# EAGLE schematic magicBoard (EAGLE 9.6.2)
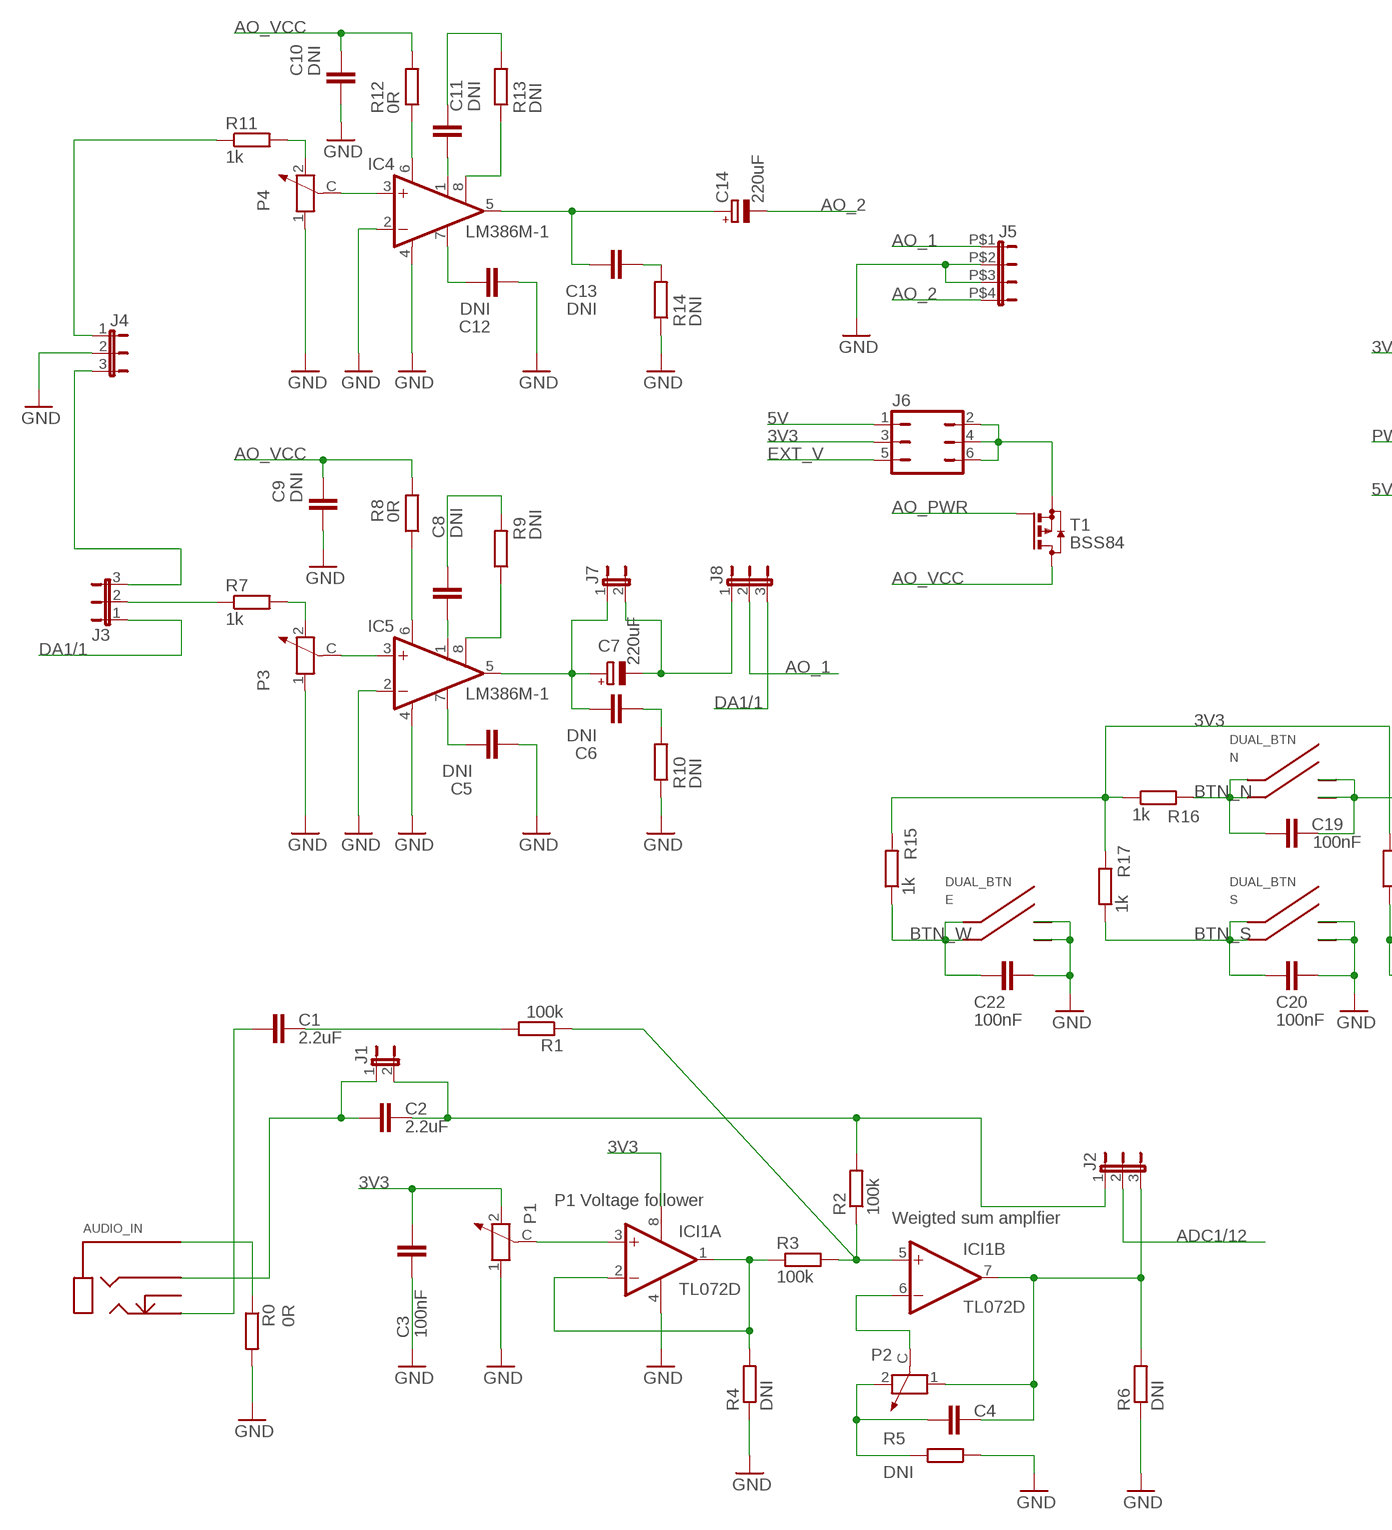
[diagram p0: schematic, sheet 1, part 1 of 2]
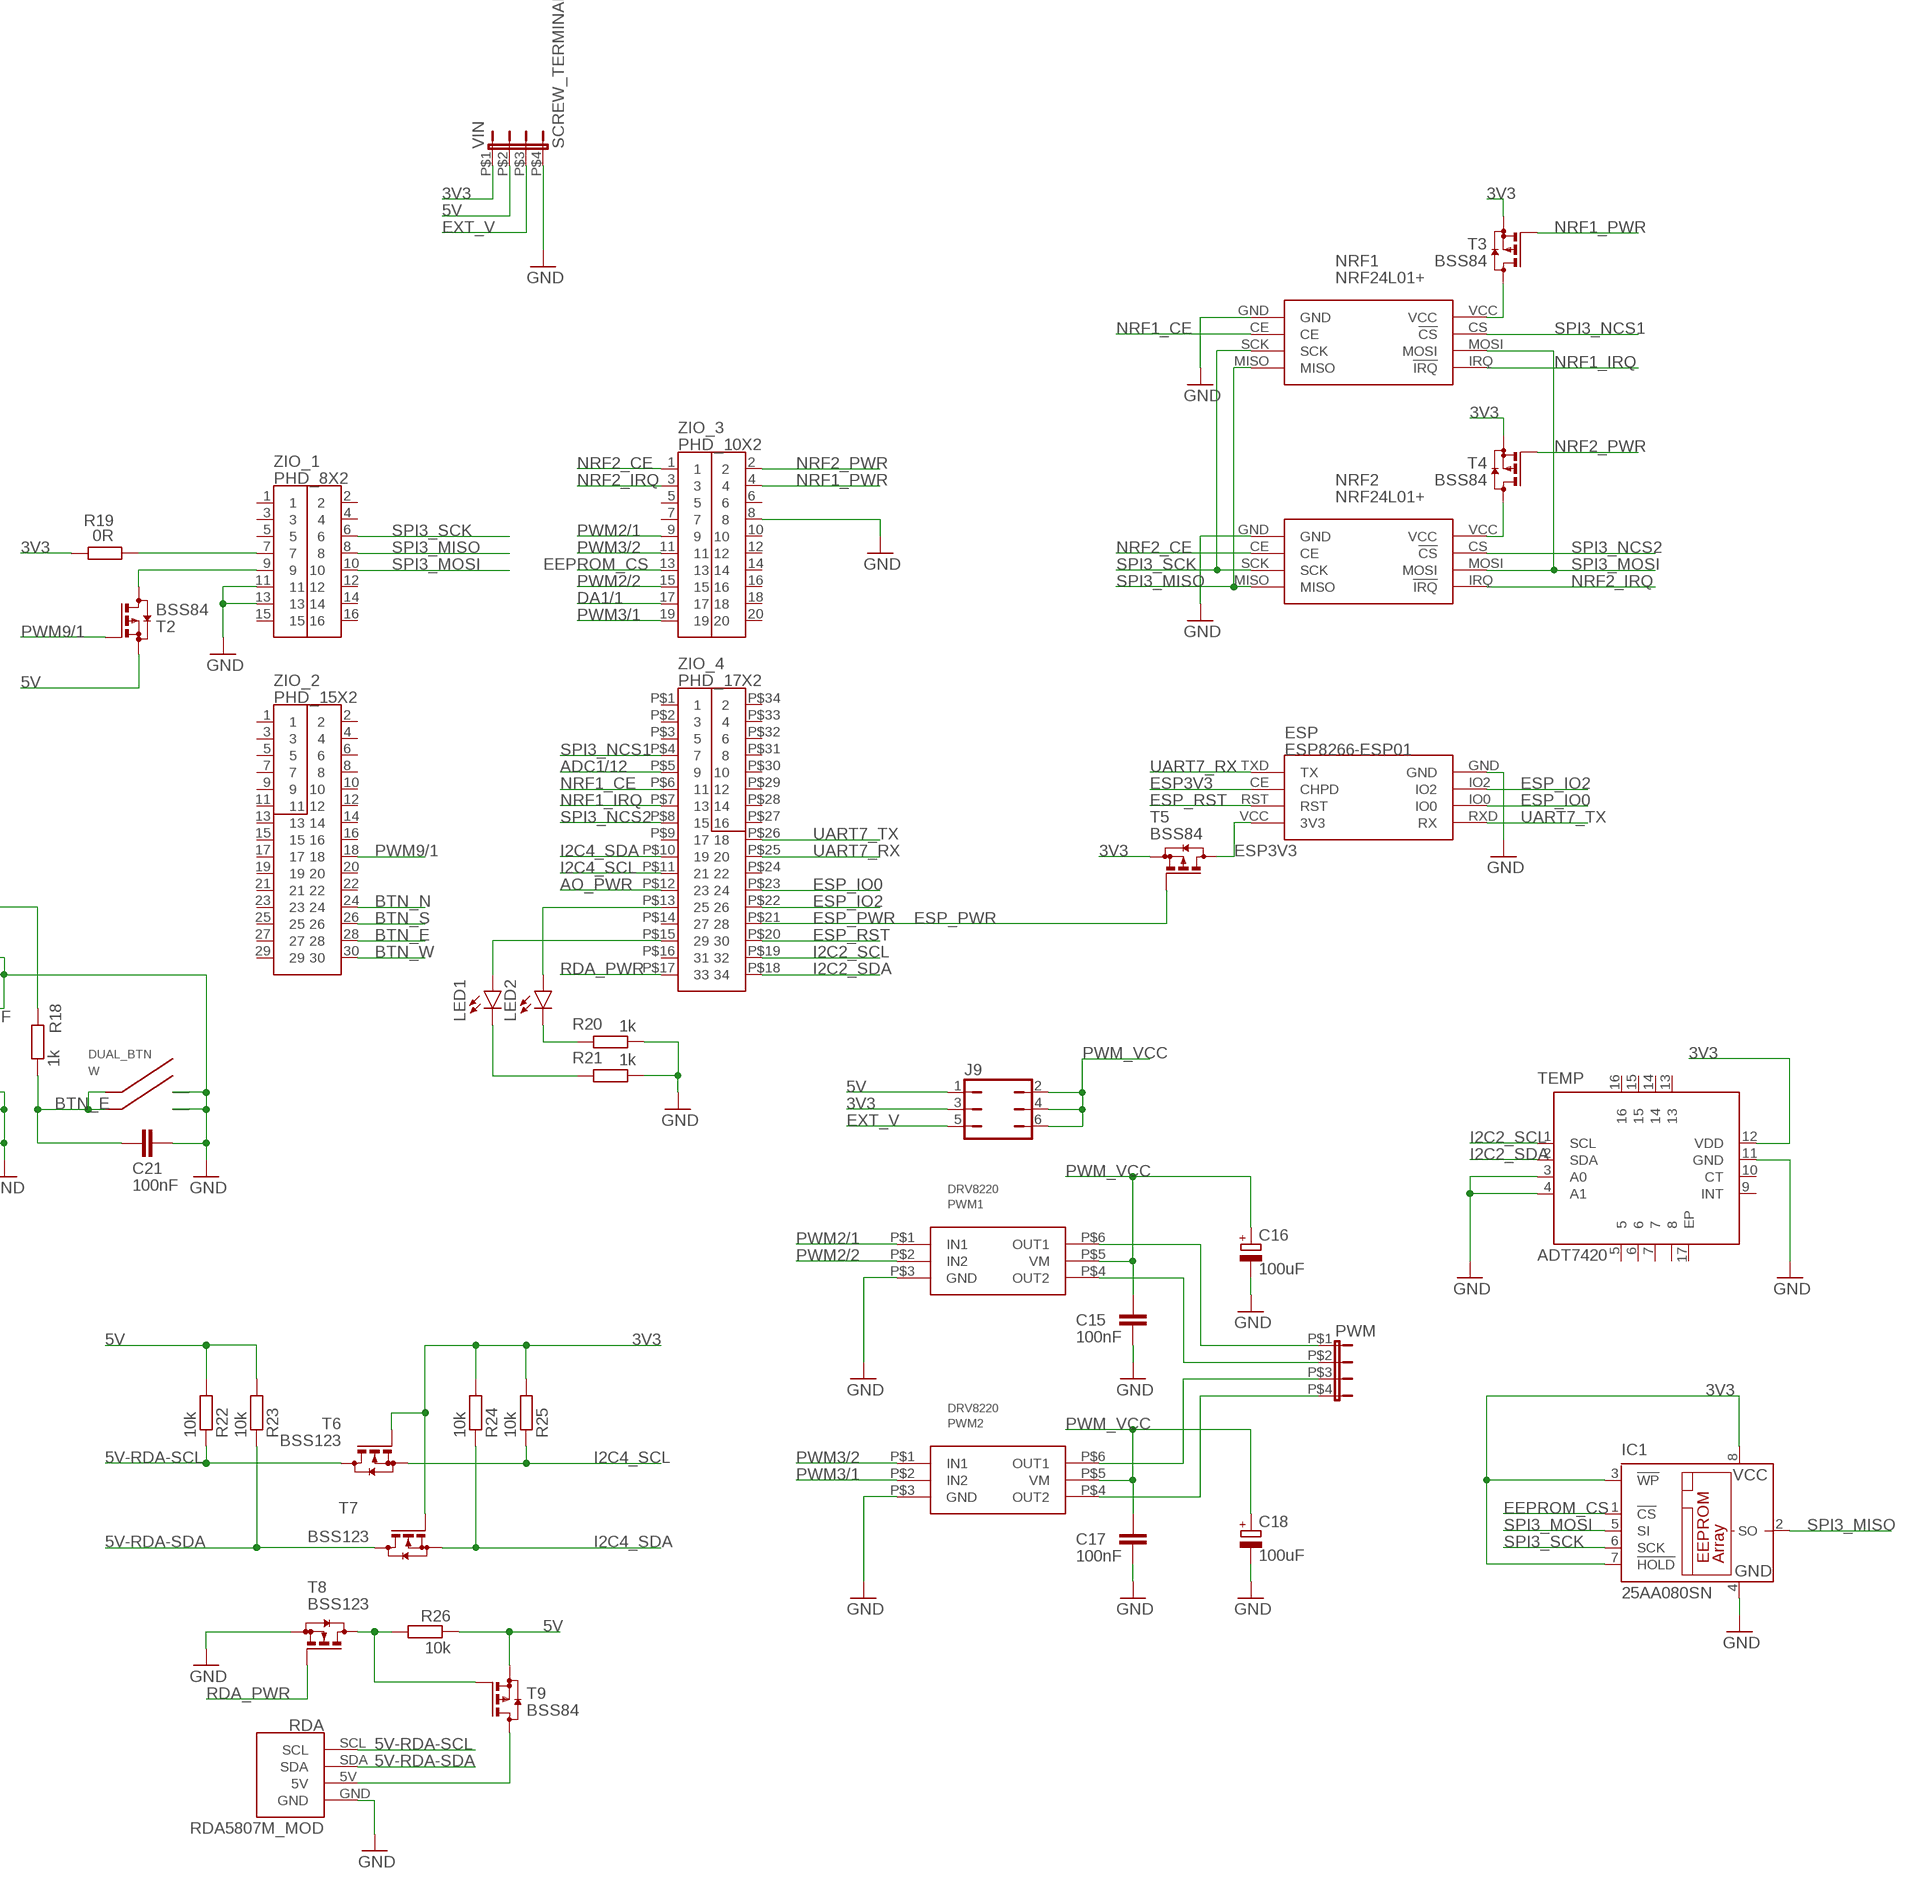
[diagram p1: schematic, sheet 1, part 2 of 2]

## Parts
AUDIO_IN  CON_JACK  [CON_JACK]
C1  2.2uF  C-EUC0805  [C0805]
C2  2.2uF  C-EUC0805  [C0805]
C3  100nF  C-EUC0805  [C0805]
C4  DNI  C-EUC0805  [C0805]
C5  DNI  C-EUC0805  [C0805]
C6  DNI  C-EUC0805  [C0805]
C7  220uF  CPOL-EUE2,5-6E  [E2,5-6E]
C8  DNI  C-EUC0805  [C0805]
C9  DNI  C-EUC0805  [C0805]
C10  DNI  C-EUC0805  [C0805]
C11  DNI  C-EUC0805  [C0805]
C12  DNI  C-EUC0805  [C0805]
C13  DNI  C-EUC0805  [C0805]
C14  220uF  CPOL-EUE2,5-6E  [E2,5-6E]
C15  100nF  C-EUC0805  [C0805]
C16  100uF  CPOL-EUE2,5-6E  [E2,5-6E]
C17  100nF  C-EUC0805  [C0805]
C18  100uF  CPOL-EUE2,5-6E  [E2,5-6E]
C19  100nF  C-EUC0805  [C0805]
C20  100nF  C-EUC0805  [C0805]
C21  100nF  C-EUC0805  [C0805]
C22  100nF  C-EUC0805  [C0805]
E  DUAL_BTN  [SMT_BTN]
ESP  ESP8266-ESP01  [ESP8266-ESP01]
IC1  25AA080SN  [SO-08]
IC4  LM386M-1  [SO08]
IC5  LM386M-1  [SO08]
ICI1  TL072D  [SO08]
J1  JP1E  [JP1]
J2  JP2E  [JP2]
J3  JP2E  [JP2]
J4  JP2E  [JP2]
J5  SCREW_TERMINAL  [SCREW_TERMINAL]
J6  JP3Q  [JP3Q]
J7  JP1E  [JP1]
J8  JP2E  [JP2]
J9  JP3Q  [JP3Q]
LED1  LEDSMT1206  [1206]
LED2  LEDSMT1206  [1206]
N  DUAL_BTN  [SMT_BTN]
NRF1  NRF24L01+  [NRF24L01+]
NRF2  NRF24L01+  [NRF24L01+]
P1  35W-POT  [35W_POT]
P2  35W-POT  [35W_POT]
P3  35W-POT  [35W_POT]
P4  35W-POT  [35W_POT]
PWM  SCREW_TERMINAL  [SCREW_TERMINAL]
PWM1  DRV8220  [SOT-5X3]
PWM2  DRV8220  [SOT-5X3]
R0  0R  R-EU_R0805  [R0805]
R1  100k  R-EU_R0805  [R0805]
R2  100k  R-EU_R0805  [R0805]
R3  100k  R-EU_R0805  [R0805]
R4  DNI  R-EU_R0805  [R0805]
R5  DNI  R-EU_R0805  [R0805]
R6  DNI  R-EU_R0805  [R0805]
R7  1k  R-EU_R0805  [R0805]
R8  0R  R-EU_R0805  [R0805]
R9  DNI  R-EU_R0805  [R0805]
R10  DNI  R-EU_R0805  [R0805]
R11  1k  R-EU_R0805  [R0805]
R12  0R  R-EU_R0805  [R0805]
R13  DNI  R-EU_R0805  [R0805]
R14  DNI  R-EU_R0805  [R0805]
R15  1k  R-EU_R0805  [R0805]
R16  1k  R-EU_R0805  [R0805]
R17  1k  R-EU_R0805  [R0805]
R18  1k  R-EU_R0805  [R0805]
R19  0R  R-EU_R0805  [R0805]
R20  1k  R-EU_R0805  [R0805]
R21  1k  R-EU_R0805  [R0805]
R22  10k  R-EU_R0805  [R0805]
R23  10k  R-EU_R0805  [R0805]
R24  10k  R-EU_R0805  [R0805]
R25  10k  R-EU_R0805  [R0805]
R26  10k  R-EU_R0805  [R0805]
RDA  RDA5807M_MOD  [RDA5807M]
S  DUAL_BTN  [SMT_BTN]
T1  BSS84  [SOT23]
T2  BSS84  [SOT23]
T3  BSS84  [SOT23]
T4  BSS84  [SOT23]
T5  BSS84  [SOT23]
T6  BSS123  [SOT23]
T7  BSS123  [SOT23]
T8  BSS123  [SOT23]
T9  BSS84  [SOT23]
TEMP  ADT7420  [LFCSP-16]
VIN  SCREW_TERMINAL  [SCREW_TERMINAL]
W  DUAL_BTN  [SMT_BTN]
ZIO_1  PHD_8X2  [PHD_8X2]
ZIO_2  PHD_15X2  [PHD_15X2]
ZIO_3  PHD_10X2  [PHD_10X2]
ZIO_4  PHD_17X2  [PHD_17X2]

## Nets
3V3: C3.1 IC1.3(!WP) IC1.7(!HOLD) IC1.8(VCC) ICI1.8(P:V+) J6.3 J9.3 P1.2 R15.2 R16.1 R17.2 R18.2 R19.2 R24.2 R25.2 T3.2(S) T4.2(S) T5.2(S) T6.1(G) T7.1(G) TEMP.12(VDD) VIN.P$1
5V: J6.1 J9.1 R22.2 R23.2 R26.1 T2.2(S) T9.2(S) VIN.P$2
5V-RDA-SCL: R22.1 RDA.SCL T6.3(D)
5V-RDA-SDA: R23.1 RDA.SDA T7.3(D)
ADC1/12: J2.2 ZIO_4.P$5
AO_1: J5.P$1 J8.2
AO_2: C14.- J5.P$4
AO_PWR: T1.1(G) ZIO_4.P$12
AO_VCC: C9.1 C10.1 R8.2 R12.2 T1.3(D)
BTN_E: C21.1 R18.1 W.H1(L1) W.H2(L2) ZIO_2.28
BTN_N: C19.1 N.H1(L1) N.H2(L2) R16.2 ZIO_2.24
BTN_S: C20.1 R17.1 S.H1(L1) S.H2(L2) ZIO_2.26
BTN_W: C22.1 E.H1(L1) E.H2(L2) R15.1 ZIO_2.30
DA1/1: J3.1 J8.3 ZIO_3.17
EEPROM_CS: IC1.1(!CS) ZIO_3.13
ESP3V3: ESP.CE(CHPD) ESP.VCC(3V3) T5.3(D)
ESP_IO0: ESP.IO0 ZIO_4.P$23
ESP_IO2: ESP.IO2 ZIO_4.P$22
ESP_PWR: T5.1(G) ZIO_4.P$21
ESP_RST: ESP.RST ZIO_4.P$20
EXT_V: J6.5 J9.5 VIN.P$3
GND: C3.2 C5.2 C9.2 C10.2 C12.2 C15.2 C16.- C17.2 C18.- C19.2 C20.2 C21.2 C22.2 E.L1(R1) E.L2(R2) ESP.GND IC1.4(GND) IC4.2(-IN) IC4.4(GND) IC5.2(-IN) IC5.4(GND) ICI1.4(P:V-) J4.2 J5.P$2 J5.P$3 N.L1(R1) N.L2(R2) NRF1.GND NRF2.GND P1.1 P3.1 P4.1 PWM1.P$3(GND) PWM2.P$3(GND) R0.2 R4.1 R5.1 R6.1 R10.1 R14.1 R20.1 R21.1 RDA.GND S.L1(R1) S.L2(R2) T8.2(S) TEMP.3(A0) TEMP.4(A1) TEMP.11(GND) VIN.P$4 W.L1(R1) W.L2(R2) ZIO_1.11 ZIO_1.13 ZIO_3.8
I2C2_SCL: TEMP.1(SCL) ZIO_4.P$19
I2C2_SDA: TEMP.2(SDA) ZIO_4.P$18
I2C4_SCL: R25.1 T6.2(S) ZIO_4.P$11
I2C4_SDA: R24.1 T7.2(S) ZIO_4.P$10
N$1: ICI1.3(A:+IN) P1.C
N$2: AUDIO_IN.4 C1.2
N$3: ICI1.1(A:OUT) ICI1.2(A:-IN) R3.1 R4.2
N$4: C1.1 R1.2
N$5: AUDIO_IN.1 R0.1
N$6: C13.1 C14.+ IC4.5(OUT)
N$7: C6.1 C7.+ IC5.5(OUT) J7.1
N$8: C6.2 R10.2
N$9: LED1.A ZIO_4.P$15
N$10: C7.- J7.2 J8.1
N$11: LED2.A ZIO_4.P$13
N$12: C4.1 ICI1.7(B:OUT) J2.3 P2.1 R6.2
N$13: ICI1.6(B:-IN) P2.C
N$14: C4.2 P2.2 R5.2
N$15: ICI1.5(B:+IN) R1.1 R2.1 R3.2
N$16: C2.1 J1.2 J2.1 R2.2
N$17: AUDIO_IN.2 C2.2 J1.1
N$18: LED2.C R20.2
N$19: J3.3 J4.3
N$20: J4.1 R11.1
N$21: IC4.3(+IN) P4.C
N$22: LED1.C R21.2
N$23: C11.2 IC4.1(GAIN)
N$24: IC5.3(+IN) P3.C
N$25: C11.1 R13.2
N$26: C12.1 IC4.7(BYPASS)
N$27: IC4.8(GAIN) R13.1
N$28: IC5.6(VS) R8.1
N$29: IC4.6(VS) R12.1
N$30: C13.2 R14.2
N$32: C8.2 IC5.1(GAIN)
N$33: C8.1 R9.2
N$34: C5.1 IC5.7(BYPASS)
N$36: IC5.8(GAIN) R9.1
N$38: J6.2 J6.4 J6.6 T1.2(S)
N$41: P4.2 R11.2
N$42: P3.2 R7.2
N$43: NRF1.VCC T3.3(D)
N$44: NRF2.VCC T4.3(D)
N$45: R26.2 T8.3(D) T9.1(G)
N$46: J3.2 R7.1
N$52: T2.3(D) ZIO_1.9
N$55: R19.1 ZIO_1.7
N$62: RDA.5V T9.3(D)
N$69: PWM1.P$6(OUT1) PWM.P$1
N$70: PWM1.P$4(OUT2) PWM.P$2
N$71: PWM2.P$6(OUT1) PWM.P$3
N$72: PWM2.P$4(OUT2) PWM.P$4
NRF1_CE: NRF1.CE ZIO_4.P$6
NRF1_IRQ: NRF1.IRQ(!IRQ) ZIO_4.P$7
NRF1_PWR: T3.1(G) ZIO_3.4
NRF2_CE: NRF2.CE ZIO_3.1
NRF2_IRQ: NRF2.IRQ(!IRQ) ZIO_3.3
NRF2_PWR: T4.1(G) ZIO_3.2
PWM2/1: PWM1.P$1(IN1) ZIO_3.9
PWM2/2: PWM1.P$2(IN2) ZIO_3.15
PWM3/1: PWM2.P$2(IN2) ZIO_3.19
PWM3/2: PWM2.P$1(IN1) ZIO_3.11
PWM9/1: T2.1(G) ZIO_2.18
PWM_VCC: C15.1 C16.+ C17.1 C18.+ J9.2 J9.4 J9.6 PWM1.P$5(VM) PWM2.P$5(VM)
RDA_PWR: T8.1(G) ZIO_4.P$17
SPI3_MISO: IC1.2(SO) NRF1.MISO NRF2.MISO ZIO_1.8
SPI3_MOSI: IC1.5(SI) NRF1.MOSI NRF2.MOSI ZIO_1.10
SPI3_NCS1: NRF1.CS(!CS) ZIO_4.P$4
SPI3_NCS2: NRF2.CS(!CS) ZIO_4.P$8
SPI3_SCK: IC1.6(SCK) NRF1.SCK NRF2.SCK ZIO_1.6
UART7_RX: ESP.TXD(TX) ZIO_4.P$25
UART7_TX: ESP.RXD(RX) ZIO_4.P$26
Unconnected: AUDIO_IN.3 TEMP.5 TEMP.6 TEMP.7 TEMP.8 TEMP.9(INT) TEMP.10(CT) TEMP.13 TEMP.14 TEMP.15 TEMP.16 TEMP.17(EP) ZIO_1.1 ZIO_1.2 ZIO_1.3 ZIO_1.4 ZIO_1.5 ZIO_1.12 ZIO_1.14 ZIO_1.15 ZIO_1.16 ZIO_2.1 ZIO_2.2 ZIO_2.3 ZIO_2.4 ZIO_2.5 ZIO_2.6 ZIO_2.7 ZIO_2.8 ZIO_2.9 ZIO_2.10 ZIO_2.11 ZIO_2.12 ZIO_2.13 ZIO_2.14 ZIO_2.15 ZIO_2.16 ZIO_2.17 ZIO_2.19 ZIO_2.20 ZIO_2.21 ZIO_2.22 ZIO_2.23 ZIO_2.25 ZIO_2.27 ZIO_2.29 ZIO_3.5 ZIO_3.6 ZIO_3.7 ZIO_3.10 ZIO_3.12 ZIO_3.14 ZIO_3.16 ZIO_3.18 ZIO_3.20 ZIO_4.P$1 ZIO_4.P$2 ZIO_4.P$3 ZIO_4.P$9 ZIO_4.P$14 ZIO_4.P$16 ZIO_4.P$24 ZIO_4.P$27 ZIO_4.P$28 ZIO_4.P$29 ZIO_4.P$30 ZIO_4.P$31 ZIO_4.P$32 ZIO_4.P$33 ZIO_4.P$34

## Notes on the sheet
- P1 Voltage follower
- Weigted sum amplfier

## Library data of the parts
AUDIO_IN = zioShield:CON_JACK
C1-C6 C8-C13 C15 C17 C19-C22 = rcl:C-EU: CAPACITOR, European symbol; SPICEPREFIX: C
C7 C14 C16 C18 = rcl:CPOL-EU: POLARIZED CAPACITOR, European symbol; SPICEPREFIX: C
E N S W = zioShield:DUAL_BTN
ESP = VladimirSustek:ESP8266-ESP01
IC1 = microchip:25*: Serial EEPROM 4K/ 8K , SPI bus; MF: MICROCHIP; MPN: 25AA080/SN; OC_FARNELL: 1816072; OC_NEWARK: 92C7351
IC4 IC5 = linear:LM386?-*: Low Voltage Audio Power Amplifier Source: http://cache.national.com/ds/LM/LM386.pdf
ICI1 = linear:TL072: OP AMP
J1 J7 = jumper:JP1E: JUMPER
J2-J4 J8 = jumper:JP2E: JUMPER
J5 PWM VIN = uni_dcdc:SCREW_TERMINAL
J6 J9 = jumper:JP3Q: JUMPER
LED1 LED2 = led:LED: LED OSRAM: - CHIPLED LG R971, LG N971, LY N971, LG Q971, LY Q971, LO R971, LY R971 LH N974, LH R974 LS Q976, LO Q976, LY Q976 LO Q996 - Hyper CHIPLED LW Q18S LB Q993, LB Q99A, LB R99A - SideLED LS A670, LO A670, LY A670, LG A670, LP A670 LB A673, LV A673, LT A673, LW A673 LH A674 LY A675 LS A676, LA A676, LO A676, LY A676, LW A676 LS A679, LY A679, LG A679 - Hyper Micro SIDELED® LS Y876, LA Y876, LO Y876, LY Y876 LT Y87S - SmartLED LW L88C, LW L88S LB L89C, LB L89S, LG L890 LS L89K, LO L89K, LY L89K LS L896, LA L896, LO L896, LY L896 - TOPLED LS T670, LO T670, LY T670, LG T670, LP T670 LSG T670, LSP T670, LSY T670, LOP T670, LYG T670 LG T671, LOG T671, LSG T671 LB T673, LV T673, LT T673, LW T673 LH T674 LS T676, LA T676, LO T676, LY T676, LB T676, LH T676, LSB T676, LW T676 LB T67C, LV T67C, LT T67C, LS T67K, LO T67K, LY T67K, LW E67C LS E67B, LA E67B, LO E67B, LY E67B, LB E67C, LV E67C, LT E67C LW T67C LS T679, LY T679, LG T679 LS T770, LO T770, LY T770, LG T770, LP T770 LB T773, LV T773, LT T773, LW T773 LH T774 LS E675, LA E675, LY E675, LS T675 LS T776, LA T776, LO T776, LY T776, LB T776 LHGB T686 LT T68C, LB T68C - Hyper Mini TOPLED® LB M676 - Mini TOPLED Santana® LG M470 LS M47K, LO M47K, LY M47K Source: http://www.osram.convergy.de LUXEON: - LUMILED® LXK2-PW12-R00, LXK2-PW12-S00, LXK2-PW14-U00, LXK2-PW14-V00 LXK2-PM12-R00, LXK2-PM12-S00, LXK2-PM14-U00 LXK2-PE12-Q00, LXK2-PE12-R00, LXK2-PE12-S00, LXK2-PE14-T00, LXK2-PE14-U00 LXK2-PB12-K00, LXK2-PB12-L00, LXK2-PB12-M00, LXK2-PB14-N00, LXK2-PB14-P00, LXK2-PB14-Q00 LXK2-PR12-L00, LXK2-PR12-M00, LXK2-PR14-Q00, LXK2-PR14-R00 LXK2-PD12-Q00, LXK2-PD12-R00, LXK2-PD12-S00 LXK2-PH12-R00, LXK2-PH12-S00 LXK2-PL12-P00, LXK2-PL12-Q00, LXK2-PL12-R00 Source: www.luxeon.com KINGBRIGHT: KA-3528ASYC Source: www.kingbright.com
NRF1 NRF2 = zioShield:NRF24L01+
P1-P4 = zioShield:35W-POT
PWM1 PWM2 = zioShield:DRV8220
R0 R1-R26 = rcl:R-EU_: RESISTOR, European symbol; SPICEPREFIX: R
RDA = zioShield:RDA5807M_MOD
T1-T5 T9 = transistor-small-signal:BSS84: P-CHANNEL MOS FET
T6-T8 = transistor-small-signal:BSS123: N-CHANNEL MOS FET
TEMP = zioShield:ADT7420
ZIO_1 = zioShield:PHD_8X2
ZIO_2 = zioShield:PHD_15X2
ZIO_3 = zioShield:PHD_10X2
ZIO_4 = zioShield:PHD_17X2